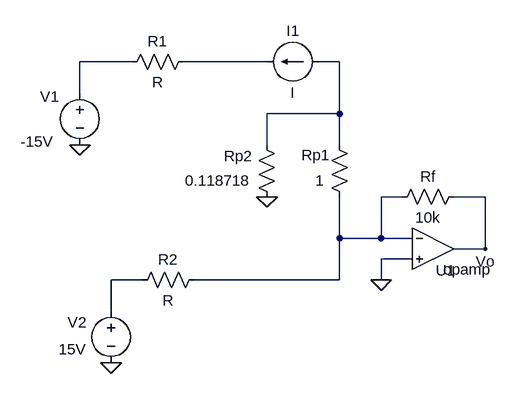
[diagram p0: schematic esercizio2mod.asc]
esercizio2mod.asc, the LTspice schematic file:
Version 4
SHEET 1 880 680
WIRE 16 -128 -64 -128
WIRE 224 -128 96 -128
WIRE 336 -128 304 -128
WIRE -64 -80 -64 -128
WIRE 336 -48 336 -128
WIRE 336 -48 224 -48
WIRE 224 0 224 -48
WIRE 336 0 336 -48
WIRE 432 80 400 80
WIRE 560 80 512 80
WIRE 336 144 336 80
WIRE 400 144 400 80
WIRE 400 144 336 144
WIRE 448 144 400 144
WIRE 560 160 560 80
WIRE 560 160 512 160
WIRE 448 176 400 176
WIRE 32 208 -16 208
WIRE 336 208 336 144
WIRE 336 208 112 208
WIRE 400 208 400 176
WIRE -16 256 -16 208
FLAG -64 0 0
FLAG -16 336 0
FLAG 400 208 0
FLAG 560 160 Vo
FLAG 224 80 0
SYMBOL res 112 -144 R90
WINDOW 0 0 56 VBottom 2
WINDOW 3 32 56 VTop 2
SYMATTR InstName R1
SYMBOL res 128 192 R90
WINDOW 0 0 56 VBottom 2
WINDOW 3 32 56 VTop 2
SYMATTR InstName R2
SYMBOL voltage -64 -96 R0
WINDOW 0 -61 22 Left 2
WINDOW 3 -91 91 Left 2
WINDOW 123 0 0 Left 0
WINDOW 39 0 0 Left 0
SYMATTR InstName V1
SYMATTR Value -15V
SYMBOL voltage -16 240 R0
WINDOW 0 -67 33 Left 2
WINDOW 3 -81 75 Left 2
SYMATTR InstName V2
SYMATTR Value 15V
SYMBOL current 304 -128 R90
WINDOW 0 -32 40 VBottom 2
WINDOW 3 32 40 VTop 2
SYMATTR InstName I1
SYMBOL OpAmps\\opamp 480 96 R0
WINDOW 0 4 97 Left 2
SYMATTR InstName U1
SYMBOL res 528 64 R90
WINDOW 0 0 56 VBottom 2
WINDOW 3 32 56 VTop 2
SYMATTR InstName Rf
SYMATTR Value 10k
SYMBOL res 320 -16 R0
WINDOW 0 -43 32 Left 2
WINDOW 3 -21 71 Left 2
SYMATTR InstName Rp1
SYMATTR Value 1
SYMBOL res 208 -16 R0
WINDOW 0 -50 33 Left 2
WINDOW 3 -110 71 Left 2
SYMATTR InstName Rp2
SYMATTR Value 0.118718

The netlist it stands for:
* esercizio2mod.asc
R1 N002 N001 R
R2 N004 N005 R
V1 N001 0 -15V
V2 N005 0 15V
I1 N003 N002 I
XU1 N004 0 Vo opamp Aol=100K GBW=10Meg  ; pins invin noninvin out
Rf Vo N004 10k
Rp1 N003 N004 1
Rp2 N003 0 0.118718
.backanno
.end